# EAGLE design brick_analog_uv (EAGLE 7.4.0)
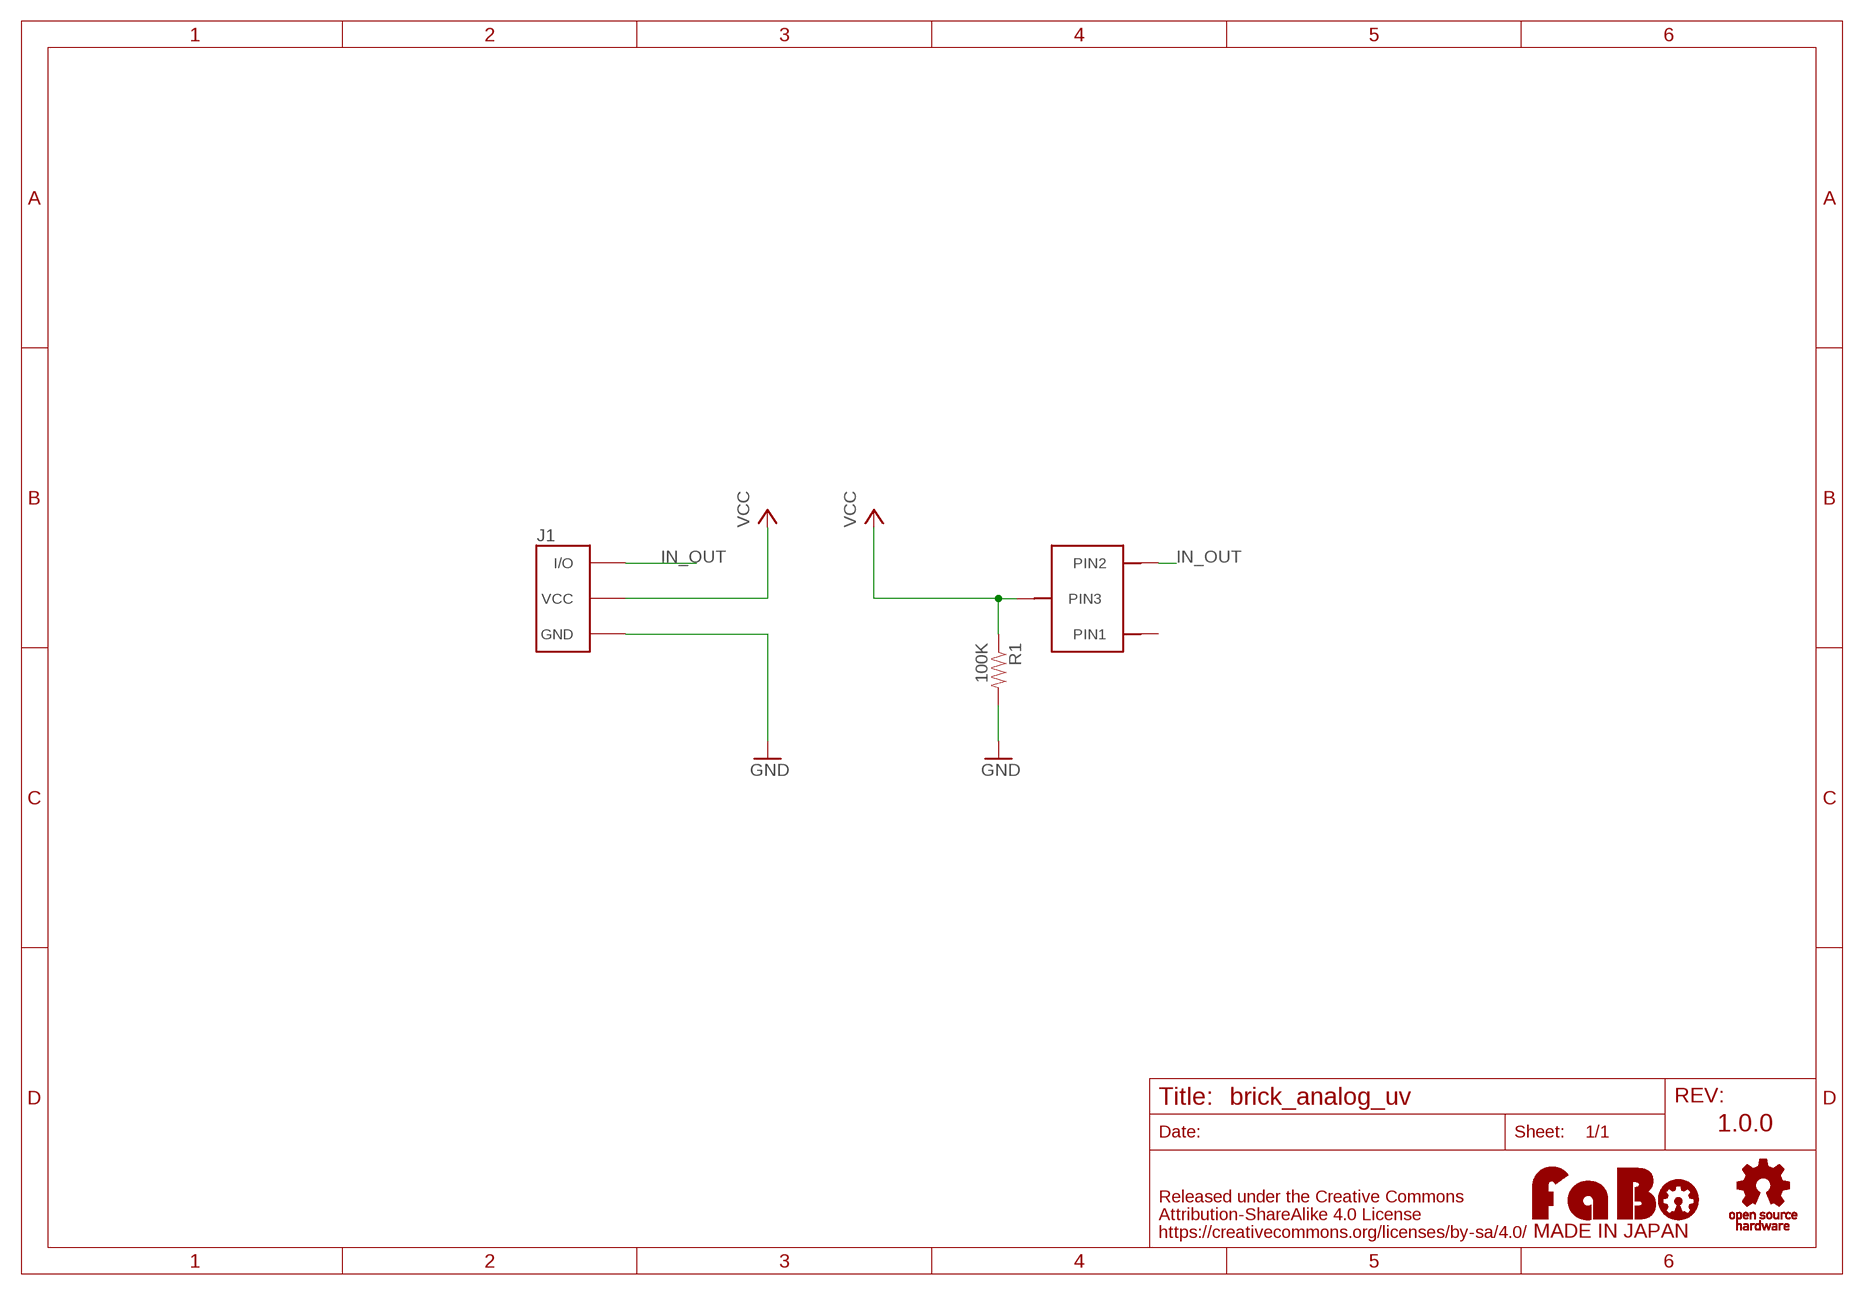
[diagram p0: schematic, sheet 1]

## Parts
J1  FABO_BRICK_3PIN  [FABO_BRICK_3PIN]
R1  100K  RESISTOR0603-RES  [0603-RES]
U1  HAMAMATSU-GAASP-G6262  [GAASP-G6262]
U$2  LOGO_OSHW-T_M  [LOGO_OSHW_T_M]
U$3  LOGO_FABO-M  [LOGO_FABO_M]

## Nets
GND: J1.GND R1.2
IN_OUT: J1.IN/OUT(I/O) U1.2(PIN2)
VCC: J1.VCC R1.1 U1.3(PIN3)
Unconnected: U1.1(PIN1)

## Notes on the sheet
- 1.0.0

## Library data of the parts
J1 = FaBo-Template:FABO_BRICK_3PIN: FaBo Brick 3pin
R1 = SparkFun:RESISTOR: Resistor Basic schematic elements and footprints for 0603, 1206, and PTH resistors.
U1 = GClueSensor:HAMAMATSU-GAASP-G6262: GaAsP G6262
U$2 = FaBo-etc:LOGO_OSHW
U$3 = FaBo-etc:LOGO_FABO

## Board
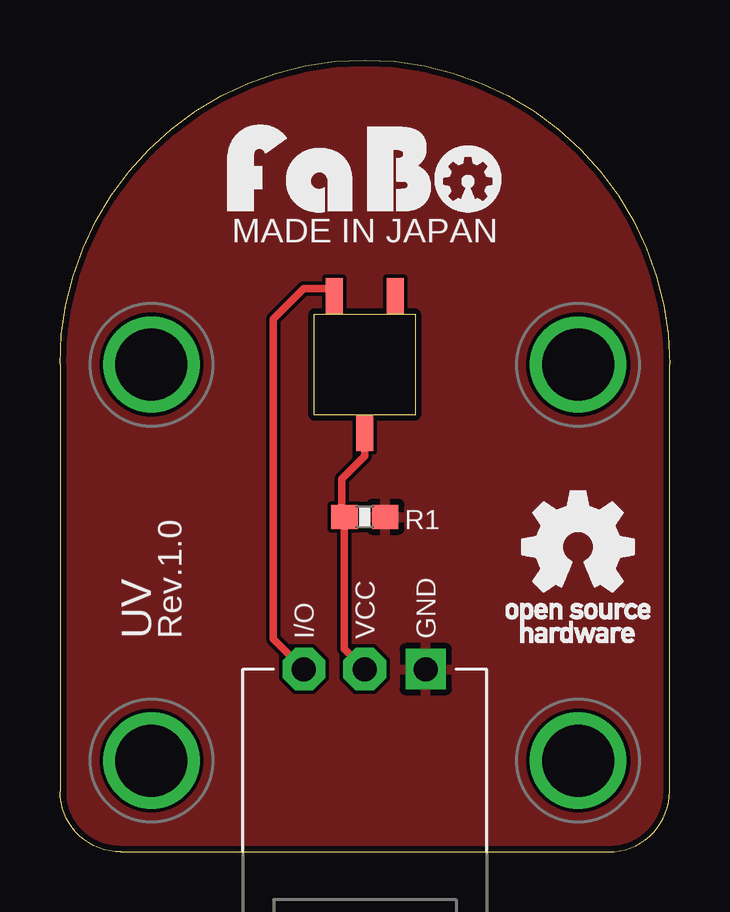
[diagram p1: board, top side]
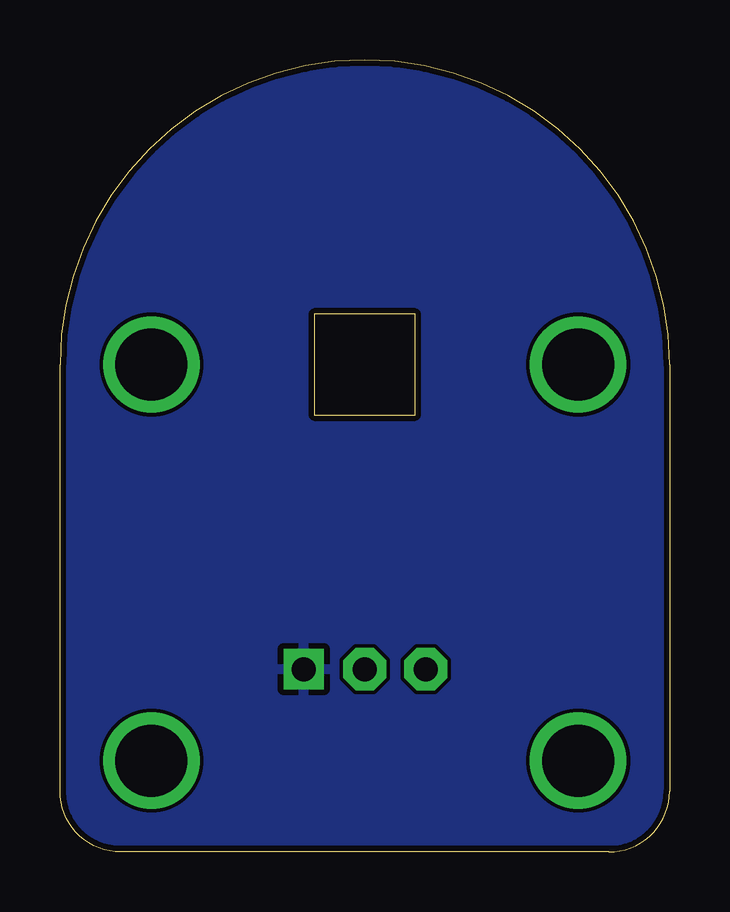
[diagram p2: board, bottom side, seen from below]

Size 25.4 x 33.02 mm. Coordinates in mm from the lower left corner, seen from the top.
Copper layers (1*16): Top 0.035mm / dielectric 1.5mm / Bottom 0.035mm
Design rules "Elecrow_2-layer_eagle_rule": minimum track width 6mil, minimum drill 12mil, track to track 6mil, track to pad 6mil, pad to pad 6mil, via to via 6mil, smd to smd 0mil, copper to edge 10mil, drill to drill 10mil, minimum pad ring 10mil, minimum via ring 6mil, stop-mask expansion 2mil, vias tented up to drill 100mil, thermal gap 10mil

### Footprints (pad centres in the part's own frame; a part is rotated, then mirrored left to right if it is on the bottom)
BRICK_3PIN = drill 1 pad 1.676 square: GND 2.54,-8.89 | drill 1 pad 1.778 octagon: IN/OUT -2.54,-8.89; VCC 0,-8.89 | drill 3 pad 3.81: P$5 -8.89,3.81; P$6 8.89,3.81; P$7 -8.89,-12.7; P$8 8.89,-12.7
0603-RES = smd 1.1 x 1: 1 -0.85,0; 2 0.85,0
GAASP-G6262 = smd 0.7 x 1.5: 1 -1.27,-2.85; 2 1.27,-2.85; 3 0,2.85

### Placement (x,y rotation side)
J1  [BRICK_3PIN]  12.7,16.51 0 top
R1  12.7,13.97 0 top
U1  12.7,20.32 180 top
U$3  [LOGO_OSHW_T_M]  21.59,12.7 0 top
U$4  [LOGO_FABO_M]  12.7,26.67 0 top

### Tracks (layer width: path | path; a pad name or v marks a point on that pad's centre or on a via)
GND
  pour Bottom: -1.27,-1.27 26.67,-1.27 26.67,34.29 -1.27,34.29
  pour Top: -1.27,-1.27 26.67,-1.27 26.67,34.29 -1.27,34.29
IN_OUT
  Top 0.305: U1.2 11.43,23.5 10.16,23.5 8.89,22.23 8.89,8.89 J1.IN/OUT
VCC
  Top 0.305: J1.VCC 11.85,8.47 R1.1 11.75,14.29 11.75,15.56 12.7,16.51 U1.3

### Text on the board
tPlace: MADE IN JAPAN | UV | Rev.1.0